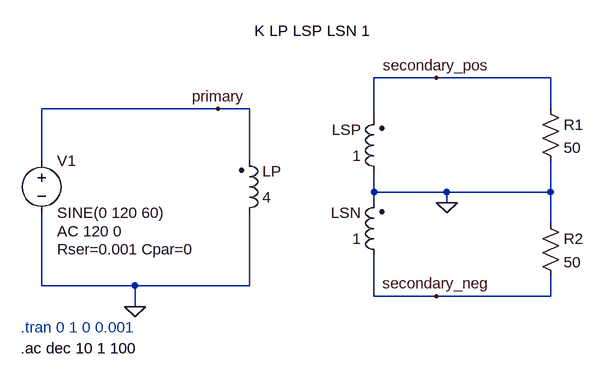
[diagram p0: schematic centertap.asc]
centertap.asc, the LTspice schematic file:
Version 4
SHEET 1 880 680
WIRE 400 -16 304 -16
WIRE 576 -16 400 -16
WIRE 64 32 -208 32
WIRE 112 32 64 32
WIRE 576 32 576 -16
WIRE 304 48 304 -16
WIRE -208 112 -208 32
WIRE 112 112 112 32
WIRE 304 160 304 128
WIRE 416 160 304 160
WIRE 576 160 576 112
WIRE 576 160 416 160
WIRE 304 176 304 160
WIRE 416 176 416 160
WIRE 576 208 576 160
WIRE -208 304 -208 192
WIRE -64 304 -208 304
WIRE 112 304 112 192
WIRE 112 304 -64 304
WIRE 304 320 304 256
WIRE 400 320 304 320
WIRE 576 320 576 288
WIRE 576 320 400 320
WIRE -64 336 -64 304
FLAG 416 176 0
FLAG -64 336 0
FLAG 64 32 primary
FLAG 400 -16 secondary_pos
FLAG 400 320 secondary_neg
SYMBOL ind2 96 208 M180
WINDOW 0 36 80 Left 2
WINDOW 3 36 40 Left 2
SYMATTR InstName LP
SYMATTR Value 4
SYMATTR Type ind
SYMATTR SpiceLine Rser=1m
SYMBOL ind2 320 144 R180
WINDOW 0 36 80 Left 2
WINDOW 3 36 40 Left 2
SYMATTR InstName LSP
SYMATTR Value 1
SYMATTR Type ind
SYMATTR SpiceLine Rser=1m
SYMBOL ind2 320 272 R180
WINDOW 0 36 80 Left 2
WINDOW 3 36 40 Left 2
SYMATTR InstName LSN
SYMATTR Value 1
SYMATTR Type ind
SYMATTR SpiceLine Rser=1m
SYMBOL voltage -208 96 R0
WINDOW 123 24 124 Left 2
WINDOW 39 24 152 Left 2
SYMATTR Value2 AC 120 0
SYMATTR SpiceLine Rser=0.001 Cpar=0
SYMATTR InstName V1
SYMATTR Value SINE(0 120 60)
SYMBOL res 560 16 R0
SYMATTR InstName R1
SYMATTR Value 50
SYMBOL res 560 192 R0
SYMATTR InstName R2
SYMATTR Value 50
TEXT 120 -88 Left 2 !K LP LSP LSN 1
TEXT -240 368 Left 2 ;.tran 0 1 0 0.001
TEXT -240 400 Left 2 !.ac dec 10 1 100

The netlist it stands for:
* centertap.asc
LP 0 primary 4 Rser=1m
LSP 0 secondary_pos 1 Rser=1m
LSN secondary_neg 0 1 Rser=1m
V1 primary 0 SINE(0 120 60) AC 120 0 Rser=0.001 Cpar=0
R1 secondary_pos 0 50
R2 0 secondary_neg 50
K LP LSP LSN 1
* .tran 0 1 0 0.001
.ac dec 10 1 100
.backanno
.end